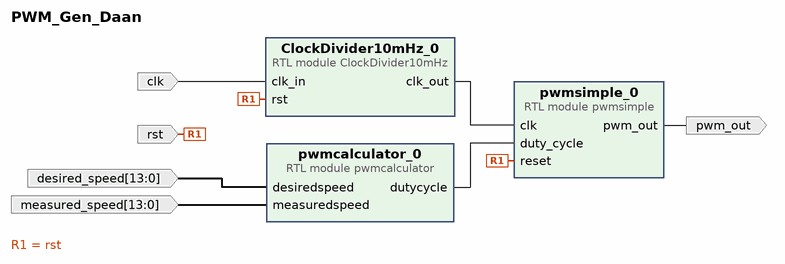
[diagram p0: block diagram of the top level]
# Vivado block design PWM_Gen_Daan, xc7z020clg400-1, Vivado 2023.1
create_bd_design PWM_Gen_Daan

create_bd_port -dir I clk
create_bd_port -dir I rst
create_bd_port -dir O pwm_out
create_bd_port -dir I -from 13 -to 0 desired_speed
create_bd_port -dir I -from 13 -to 0 measured_speed

create_bd_cell -type module -reference ClockDivider10mHz ClockDivider10mHz_0
create_bd_cell -type module -reference pwmsimple pwmsimple_0
create_bd_cell -type module -reference pwmcalculator pwmcalculator_0

# ---- connections ----

connect_bd_net [get_bd_pins ClockDivider10mHz_0/clk_out] [get_bd_pins pwmsimple_0/clk]
connect_bd_net [get_bd_ports clk] [get_bd_pins ClockDivider10mHz_0/clk_in]
connect_bd_net [get_bd_ports desired_speed] [get_bd_pins pwmcalculator_0/desiredspeed]
connect_bd_net [get_bd_ports measured_speed] [get_bd_pins pwmcalculator_0/measuredspeed]
connect_bd_net [get_bd_pins pwmcalculator_0/dutycycle] [get_bd_pins pwmsimple_0/duty_cycle]
connect_bd_net [get_bd_pins pwmsimple_0/pwm_out] [get_bd_ports pwm_out]
connect_bd_net [get_bd_ports rst] [get_bd_pins ClockDivider10mHz_0/rst] [get_bd_pins pwmsimple_0/reset]

validate_bd_design
save_bd_design
